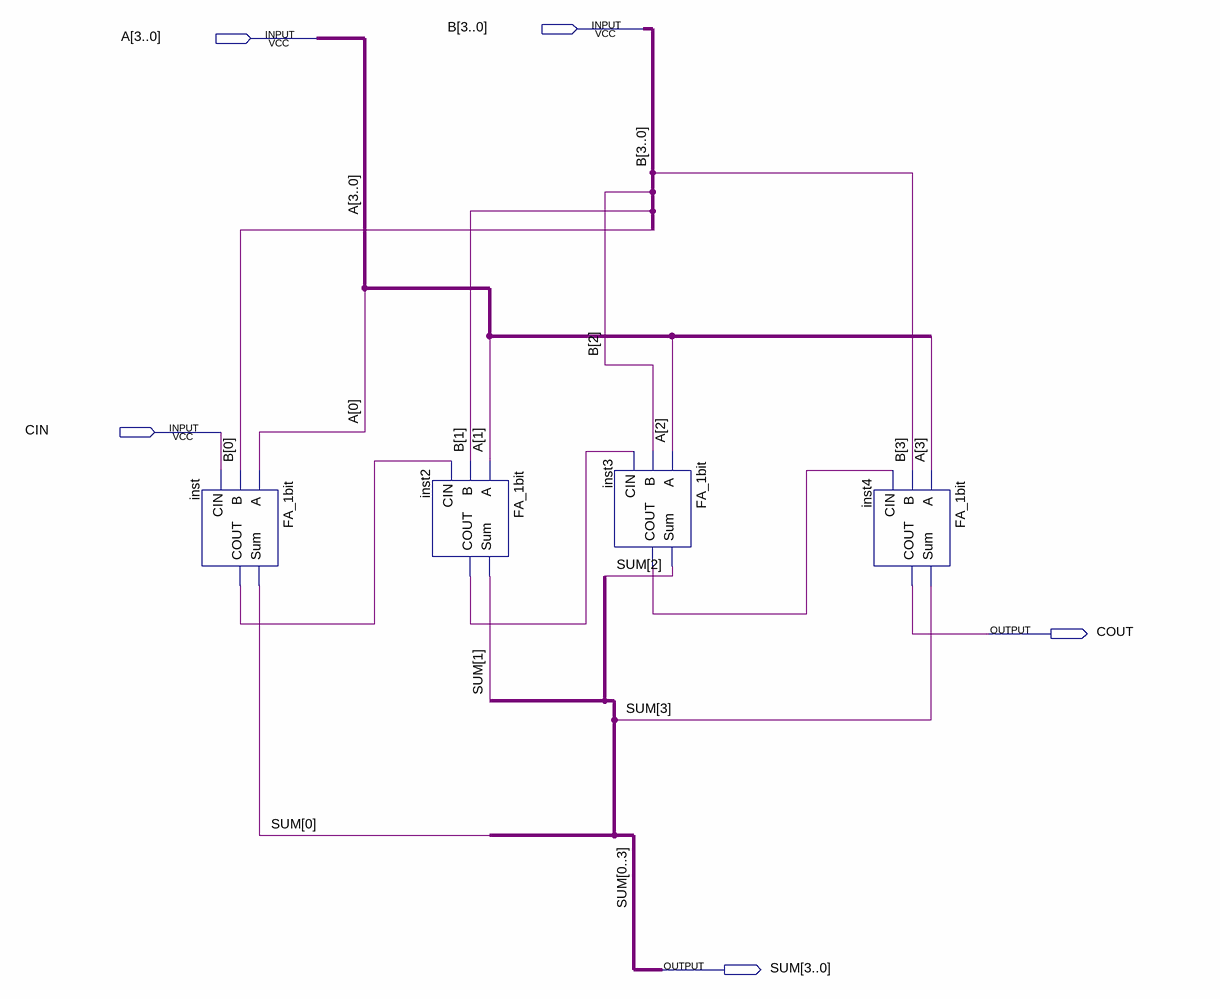
[diagram p0: schematic sheet]
// Quartus schematic FA_4bit.bdf as structural Verilog: 4 symbols, 5 pins
module FA_4bit (
  input  [3:0] B,
  input  [3:0] A,
  input  CIN,
  output COUT,
  output [3:0] SUM
);

  wire inst2_cout, inst3_cout, inst_cout;

  FA_1bit inst (.A(A[0]), .B(B[0]), .CIN(CIN), .Sum(SUM[0]), .COUT(inst_cout));
  FA_1bit inst2 (.A(A[1]), .B(B[1]), .CIN(inst_cout), .Sum(SUM[1]), .COUT(inst2_cout));
  FA_1bit inst3 (.A(A[2]), .B(B[2]), .CIN(inst2_cout), .Sum(SUM[2]), .COUT(inst3_cout));
  FA_1bit inst4 (.A(A[3]), .B(B[3]), .CIN(inst3_cout), .Sum(SUM[3]), .COUT(COUT));
endmodule
